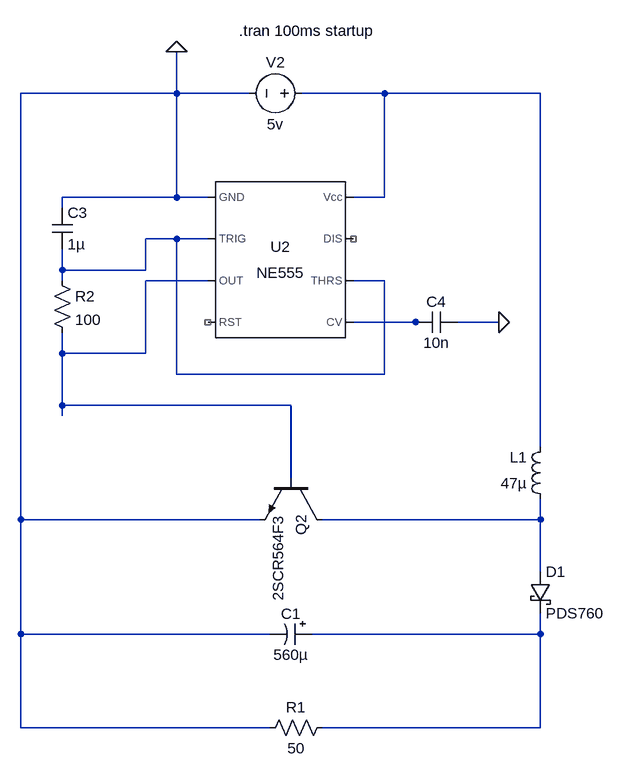
[diagram p0: schematic dc-dc-boost.asc]
dc-dc-boost.asc, the LTspice schematic file:
Version 4
SHEET 1 3044 680
WIRE 560 -1344 560 -1408
WIRE 560 -1344 320 -1344
WIRE 672 -1344 560 -1344
WIRE 880 -1344 752 -1344
WIRE 1120 -1344 880 -1344
WIRE 560 -1184 560 -1344
WIRE 560 -1184 384 -1184
WIRE 608 -1184 560 -1184
WIRE 880 -1184 880 -1344
WIRE 880 -1184 832 -1184
WIRE 384 -1168 384 -1184
WIRE 560 -1120 512 -1120
WIRE 608 -1120 560 -1120
WIRE 384 -1072 384 -1104
WIRE 512 -1072 512 -1120
WIRE 512 -1072 384 -1072
WIRE 384 -1056 384 -1072
WIRE 608 -1056 512 -1056
WIRE 880 -1056 832 -1056
WIRE 928 -992 832 -992
WIRE 944 -992 928 -992
WIRE 1056 -992 992 -992
WIRE 384 -944 384 -976
WIRE 512 -944 512 -1056
WIRE 512 -944 384 -944
WIRE 560 -912 560 -1120
WIRE 880 -912 880 -1056
WIRE 880 -912 560 -912
WIRE 384 -864 384 -944
WIRE 736 -864 384 -864
WIRE 384 -848 384 -864
WIRE 1120 -800 1120 -1344
WIRE 736 -752 736 -864
WIRE 320 -688 320 -1344
WIRE 688 -688 320 -688
WIRE 1120 -688 1120 -720
WIRE 1120 -688 784 -688
WIRE 1120 -608 1120 -688
WIRE 320 -512 320 -688
WIRE 704 -512 320 -512
WIRE 1120 -512 1120 -544
WIRE 1120 -512 768 -512
WIRE 320 -368 320 -512
WIRE 704 -368 320 -368
WIRE 1120 -368 1120 -512
WIRE 1120 -368 784 -368
FLAG 1056 -992 0
FLAG 560 -1408 0
SYMBOL Misc\\NE555 720 -1088 R0
SYMATTR InstName U2
SYMBOL voltage 768 -1344 R90
WINDOW 0 -32 56 VBottom 2
WINDOW 3 32 56 VTop 2
WINDOW 123 0 0 Left 0
WINDOW 39 0 0 Left 0
SYMATTR InstName V2
SYMATTR Value 5v
SYMBOL cap 368 -1168 R0
SYMATTR InstName C3
SYMATTR Value 1µ
SYMBOL res 368 -1072 R0
SYMATTR InstName R2
SYMATTR Value 100
SYMBOL cap 992 -1008 R90
WINDOW 0 0 32 VBottom 2
WINDOW 3 32 32 VTop 2
SYMATTR InstName C4
SYMATTR Value 10n
SYMBOL ind 1136 -704 R180
WINDOW 0 36 80 Left 2
WINDOW 3 36 40 Left 2
SYMATTR InstName L1
SYMATTR Value 47µ
SYMATTR SpiceLine Ipk=3 Rser=0.053 Rpar=21893 Cpar=11.661p mfg="Würth Elektronik" pn="744770147 WE-PD 1280"
SYMBOL schottky 1104 -608 R0
SYMATTR InstName D1
SYMATTR Value PDS760
SYMATTR Description Diode
SYMATTR Type diode
SYMBOL res 800 -384 R90
WINDOW 0 0 56 VBottom 2
WINDOW 3 32 56 VTop 2
SYMATTR InstName R1
SYMATTR Value 50
SYMBOL polcap 768 -528 R90
WINDOW 0 0 32 VBottom 2
WINDOW 3 32 32 VTop 2
SYMATTR InstName C1
SYMATTR Value 560µ
SYMATTR Description Capacitor
SYMATTR Type cap
SYMBOL npn 784 -752 R90
SYMATTR InstName Q2
SYMATTR Value 2SCR564F3
TEXT 656 -1440 Left 2 !.tran 100ms startup

The netlist it stands for:
* dc-dc-boost.asc
XU2 0 N002 N003 NC_01 N004 N002 NC_02 N001 NE555  ; pins GND TRIG OUT RST CV THRS DIS Vcc
V2 N001 0 5v
C3 0 N002 1µ
R2 N002 N003 100
C4 0 N004 10n
L1 N005 N001 47µ Ipk=3 Rser=0.053 Rpar=21893 Cpar=11.661p mfg="Würth Elektronik" pn="744770147 WE-PD 1280"
D1 N005 N006 PDS760
R1 N006 0 50
C1 N006 0 560µ
Q2 N005 N003 0 0 2SCR564F3
.model D D
.lib standard.dio
.model NPN NPN
.model PNP PNP
.lib standard.bjt
.tran 100ms startup
.lib NE555.sub
.backanno
.end